# EAGLE design simple-spectro (EAGLE 9.2.2)
DELETE: MF
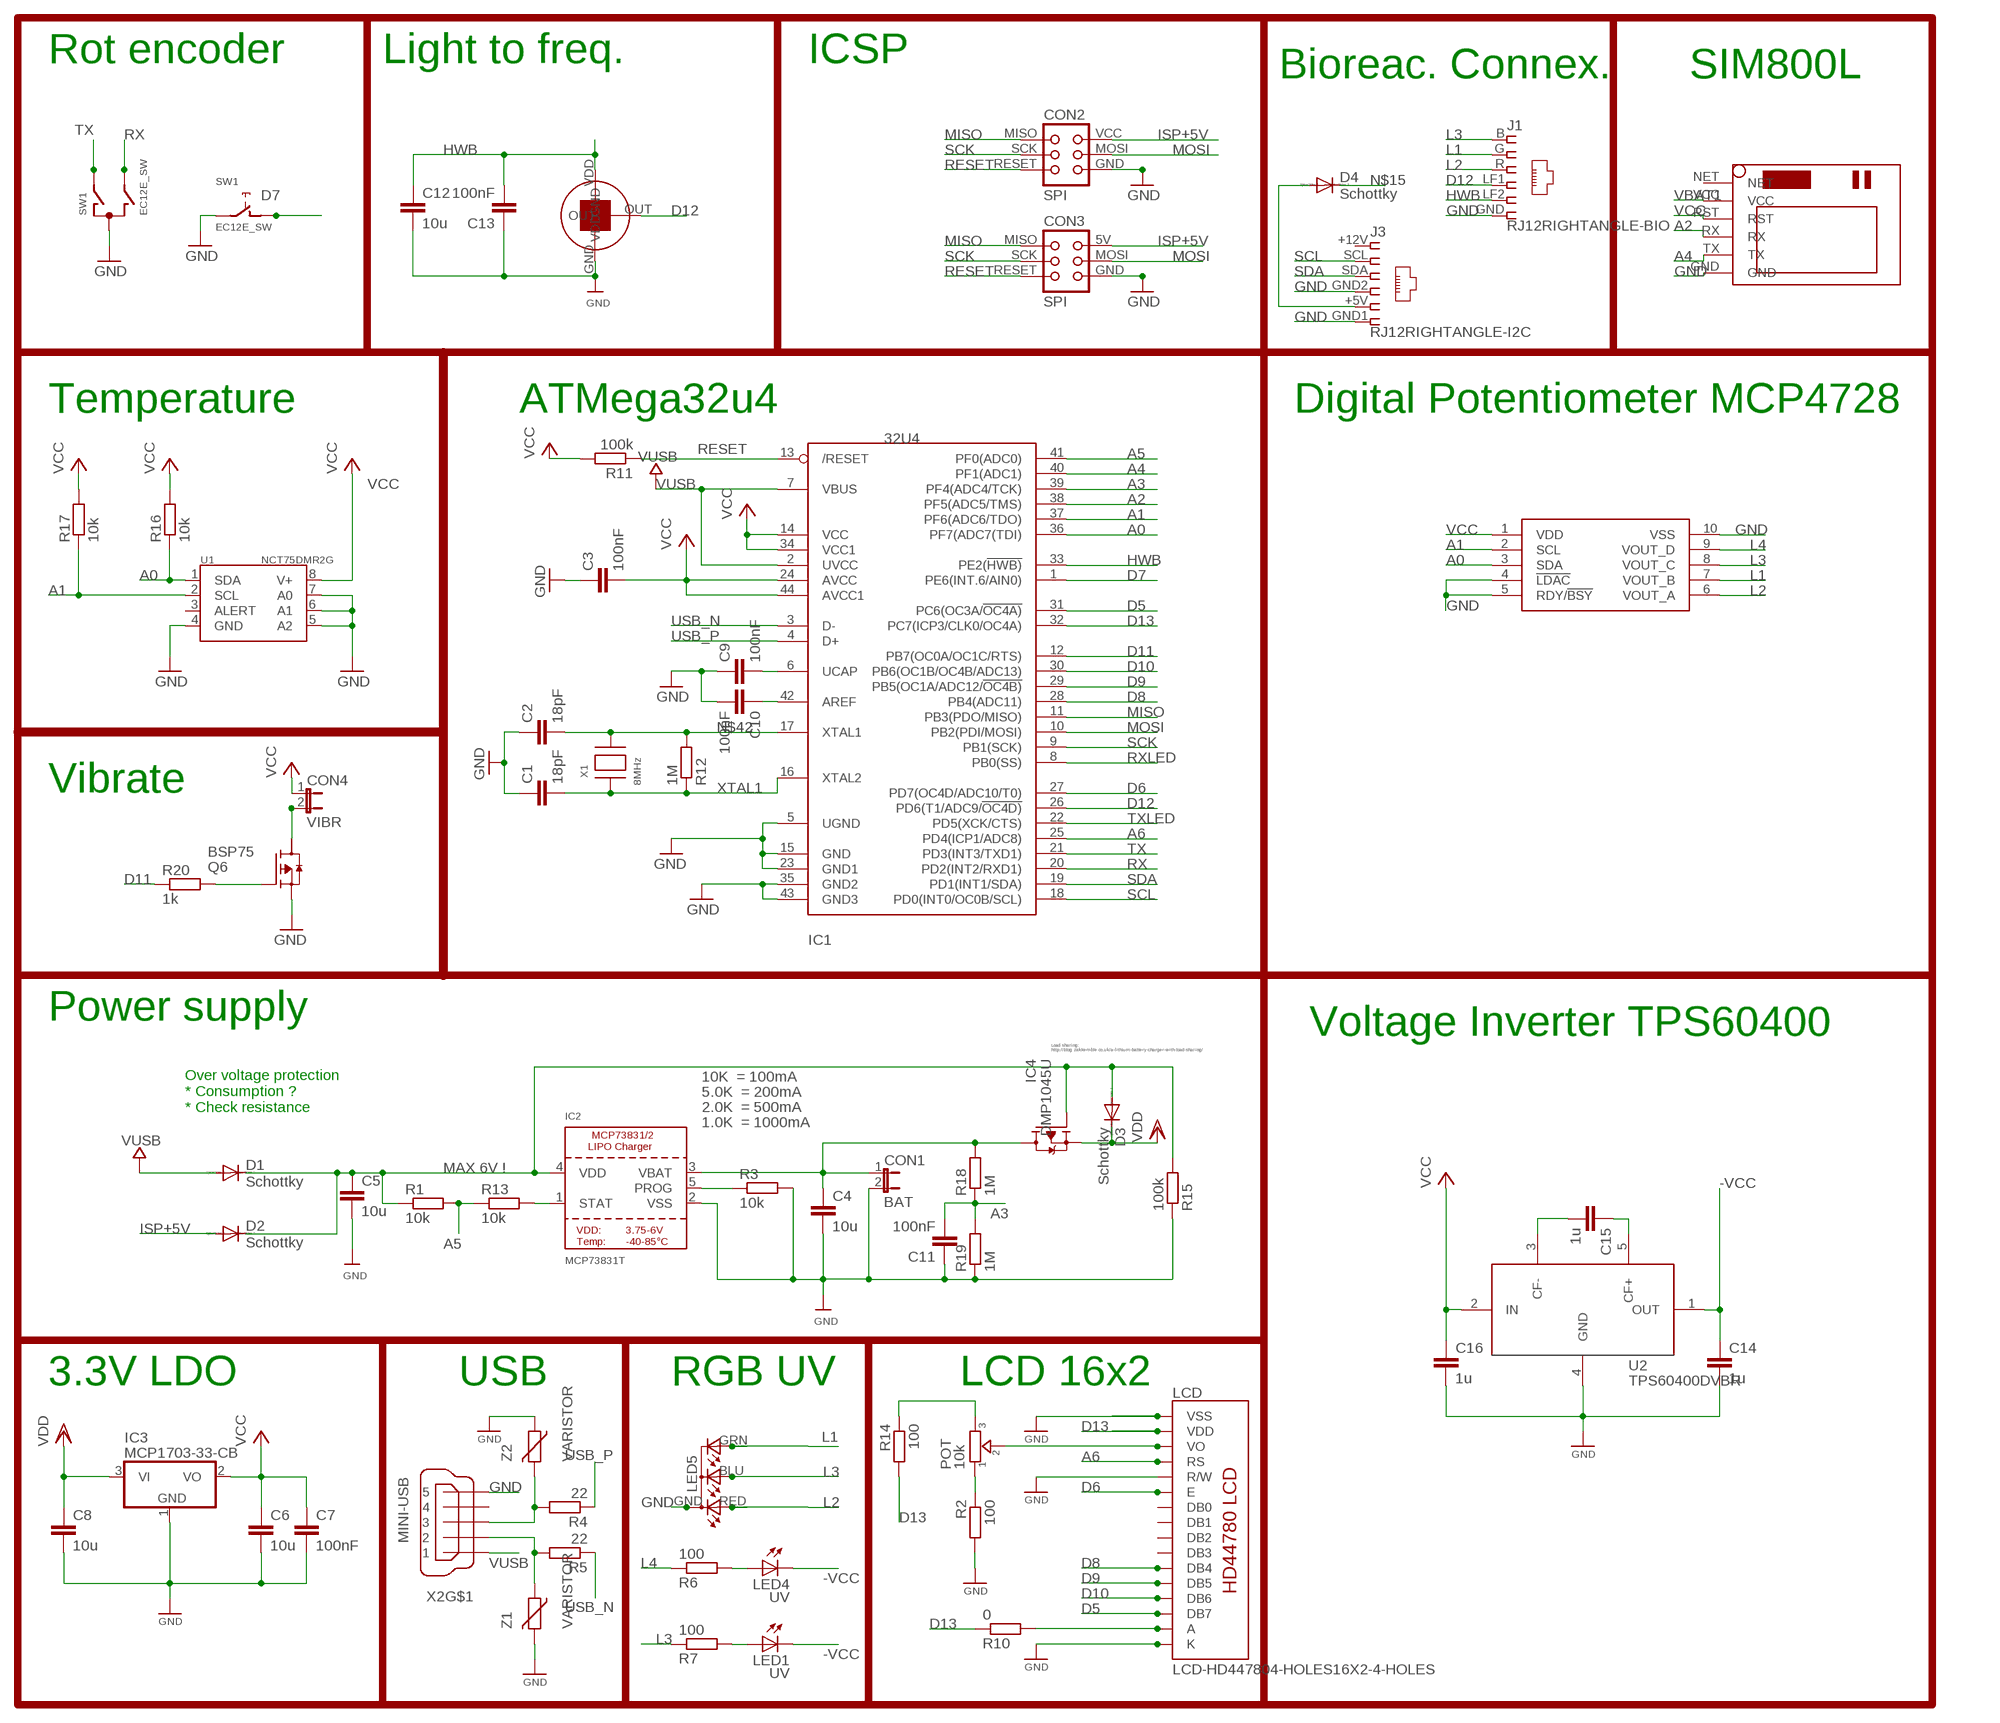
[diagram p0: schematic, sheet 1]

## Parts
C1  18pF  C-EUC0805K  [C0805K]
C2  18pF  C-EUC0805K  [C0805K]
C3  100nF  C-EUC0805K  [C0805K]
C4  10u  C-EUC0805K  [C0805K]
C5  10u  C-EUC0805K  [C0805K]
C6  10u  C-EUC0805K  [C0805K]
C7  100nF  C-EUC0805K  [C0805K]
C8  10u  C-EUC0805K  [C0805K]
C9  100nF  C-EUC0805K  [C0805K]
C10  100nF  C-EUC0805K  [C0805K]
C11  100nF  C-EUC0805K  [C0805K]
C12  10u  C-EUC0805K  [C0805K]
C13  100nF  C-EUC0805K  [C0805K]
C14  1u  C-EUC0805K  [C0805K]
C15  1u  C-EUC0805K  [C0805K]
C16  1u  C-EUC0805K  [C0805K]
CON1  BAT  JP1E  [JP1]
CON2  SPI  TINYISP  [TINYISP]
CON3  SPI  TINYISPT  [TC2030-MCP-NL]
CON4  VIBR  JP1E  [JP1]
D1  Schottky  MBR0520LT  [SOD123]
D2  Schottky  MBR0520LT  [SOD123]
D3  Schottky  MBR0520LT  [SOD123]
D4  Schottky  MBR0520LT  [SOD123]
IC1  32U4  ATMEGA32U4-AU  [TQFP44]
IC2  MCP73831T  MCP73831/2  [SOT23-5]
IC3  MCP1703-33-CB  MCP1703CB  [SOT23]
IC4  DMP1045U  TRANSISTOR_FET_TSM2301CX  [SOT-23]
J1  RJ12RIGHTANGLE-BIO  [RJ12-RIGHTRANGE-RGB]
J3  RJ12RIGHTANGLE-I2C  [RJ12-RIGHTANGLE-I2C]
LCD  LCD-HD447804-HOLES16X2-4-HOLES  [LCD-16X2-4HOLES]
LED1  UV  LED5MM  [LED5MM]
LED4  UV  LED5MM  [LED5MM]
LED5  RGB-COMMON-CATHODE  [LED-TRICOLOR-THROUGHHOLE]
POT  10k  TRIMMER-3362P  [TRIMMER_3362P]
Q6  BSP75  [PG-SOT-223]
R1  10k  R-EU_R0805  [R0805]
R2  100  R-EU_R0805  [R0805]
R3  10k  R-EU_R0805  [R0805]
R4  22  R-EU_R0805  [R0805]
R5  22  R-EU_R0805  [R0805]
R6  100  R-EU_R0805  [R0805]
R7  100  R-EU_R0805  [R0805]
R10  0  R-EU_R0805  [R0805]
R11  100k  R-EU_R0805  [R0805]
R12  1M  R-EU_R0805  [R0805]
R13  10k  R-EU_R0805  [R0805]
R14  100  R-EU_R0805  [R0805]
R15  100k  R-EU_R0805  [R0805]
R16  10k  R-EU_R0805  [R0805]
R17  10k  R-EU_R0805  [R0805]
R18  1M  R-EU_R0805  [R0805]
R19  1M  R-EU_R0805  [R0805]
R20  1k  R-EU_R0805  [R0805]
SW1  EC12E_SW  [ALPS_EC12E_SW]
U1  NCT75DMR2G  TMP75DGK  [MSOP8]
U2  TPS60400DVBR  [SOT23-5]
U$1  SIM800LMODULE  [SIM800LMODULE]
U$4  MCP4728  [MSOP10]
U$7  TSL237  [TSL237]
X1  8MHz  XTALNX6035  [NX6035]
X2  MINI-USB  MINI-USB-SCHIELD-32005-201  [32005-201]
Z1  VARISTOR  VARISTORCN0603  [CT/CN0603]
Z2  VARISTOR  VARISTORCN0603  [CT/CN0603]

## Nets
-VCC: C14.1 LED1.K(C) LED4.K(C) U2.1(OUT)
A0: IC1.36(PF7(ADC7(TDI)) R16.1 U1.1(SDA) U$4.3(SDA)
A1: IC1.37(PF6(ADC6/TDO)) R17.1 U1.2(SCL) U$4.2(SCL)
A2: IC1.38(PF5(ADC5/TMS)) U$1.RX
A3: C11.2 IC1.39(PF4(ADC4/TCK)) R18.1 R19.2
A4: IC1.40(PF1(ADC1)) U$1.TX
A5: IC1.41(PF0(ADC0)) R1.2 R13.1
A6: IC1.25(PD4(ICP1/ADC8)) LCD.4(RS)
AREF: C10.1 IC1.42(AREF)
D5: IC1.31(PC6(OC3A/!OC4A)) LCD.14(DB7)
D6: IC1.27(PD7(OC4D/ADC10/T0)) LCD.6(E)
D7: IC1.1(PE6(INT.6/AIN0)) SW1.D
D8: IC1.28(PB4(ADC11)) LCD.11(DB4)
D9: IC1.29(PB5(OC1A/ADC12/!OC4B)) LCD.12(DB5)
D10: IC1.30(PB6(OC1B/OC4B/ADC13)) LCD.13(DB6)
D11: IC1.12(PB7(OC0A/OC1C/RTS)) R20.1
D12: IC1.26(PD6(T1/ADC9/!OC4D)) J1.LF1 U$7.OUT
D13: IC1.32(PC7(ICP3/CLK0/OC4A)) LCD.2(VDD) R10.1 R14.2
GND [power]: C1.1 C2.1 C3.1 C4.2 C5.2 C6.2 C7.2 C8.2 C9.1 C10.2 C11.1 C12.2 C13.1 C14.2 C16.2 CON1.2 CON2.GND CON3.GND IC1.5(UGND) IC1.15(GND) IC1.23(GND1) IC1.35(GND2) IC1.43(GND3) IC2.2(VSS) IC3.1(GND) J1.GND J3.GND1 J3.GND2 LCD.1(VSS) LCD.5(R/W) LCD.16(K) LED5.GND(A2) Q6.3(S) R2.2 R3.2 R15.1 R19.1 SW1.C SW1.E U1.4(GND) U1.5(A2) U1.6(A1) U1.7(A0) U2.4(GND) U$1.GND U$4.4(!LDAC) U$4.5(RDY/!BSY) U$4.10(VSS) U$7.GND X2.5 Z1.2 Z2.1
HWB: C12.1 C13.2 IC1.33(PE2(!HWB)) J1.LF2 U$7.VDD
ISP+5V: CON2.VCC CON3.5V(VCC) D2.A
L1: J1.G LED5.GRN(CGREEN) U$4.7(VOUT_B)
L2: J1.R LED5.RED(CRED) U$4.6(VOUT_A)
L3: J1.B LED5.BLU(CBLUE) R7.1 U$4.8(VOUT_C)
L4: R6.1 U$4.9(VOUT_D)
MISO: CON2.MISO CON3.MISO IC1.11(PB3(PDO/MISO))
MOSI: CON2.MOSI CON3.MOSI IC1.10(PB2(PDI/MOSI))
N$1: C9.2 IC1.6(UCAP)
N$2: LCD.3(VO) POT.2
N$3: D4.A J3.+5V
N$4: POT.1 R2.1
N$5: IC2.1(STAT) R13.2
N$6: IC2.5(PROG) R3.1
N$7: LED4.A R6.2
N$8: Q6.1(G) R20.2
N$9: LED1.A R7.2
N$11: LCD.15(A) R10.2
N$12: POT.3 R14.1
N$14: CON4.2 Q6.2(D)
N$15: C5.1 D1.C D2.C D3.A D4.C IC2.4(VDD) IC4.1(G) R1.1 R15.2
N$17: C15.2 U2.3(CF-)
N$18: C15.1 U2.5(CF+)
N$42: C2.2 IC1.17(XTAL1) R12.2 X1.P$2
RESET: CON2.RESET CON3.RESET IC1.13(/RESET) R11.1
RX: IC1.20(PD2(INT2/RXD1)) SW1.B
RXLED: IC1.8(PB0(SS))
SCK: CON2.SCK CON3.SCK IC1.9(PB1(SCK))
SCL: IC1.18(PD0(INT0/OC0B/SCL)) J3.SCL
SDA: IC1.19(PD1(INT1/SDA)) J3.SDA
TX: IC1.21(PD3(INT3/TXD1)) SW1.A
TXLED: IC1.22(PD5(XCK/CTS))
USB_N: IC1.3(D-) R5.1
USB_P: IC1.4(D+) R4.1
USBC_N: R5.2 X2.2 Z1.1
USBC_P: R4.2 X2.3 Z2.2
VBAT1: C4.1 CON1.1 IC2.3(VBAT) IC4.3(D) R18.2 U$1.VCC
VCC: C3.2 C6.1 C7.1 C16.1 CON4.1 IC1.14(VCC) IC1.24(AVCC) IC1.34(VCC1) IC1.44(AVCC1) IC3.2(VO) R11.2 R16.2 R17.2 U1.8(V+) U2.2(IN) U$1.RST U$4.1(VDD)
VDD [power]: C8.1 D3.C IC3.3(VI) IC4.2(S)
VUSB: D1.A IC1.2(UVCC) IC1.7(VBUS) X2.1
XTAL1: C1.2 IC1.16(XTAL2) R12.1 X1.P$1
Unconnected: LCD.7(DB0) LCD.8(DB1) LCD.9(DB2) LCD.10(DB3) Q6.4(D) SW1.GND1(G) SW1.GND2(G) U1.3(ALERT) U$1.NET X2.4 X2.M1(S:S1) X2.M2(S:S2) X2.M3(S:S3) X2.M4(S:S4)

## Notes on the sheet
- Rot encoder | Light to freq. | ICSP
- Bioreac. Connex. | SIM800L
- Temperature | ATMega32u4 | Digital Potentiometer MCP4728
- Vibrate
- Power supply
- Voltage Inverter TPS60400
- Load sharing:
  http://blog.zakkemble.co.uk/a-lithium-battery-charger-with-load-sharing/
- 10K  = 100mA
- 5.0K  = 200mA
- Over voltage protection
  * Consumption ?
  * Check resistance
- 2.0K  = 500mA
- 1.0K  = 1000mA
- MAX 6V !
- 3.3V LDO | USB | RGB UV | LCD 16x2

## Power pins joined to a net without a drawn wire
1: J3.+12V

## Library data of the parts
C1 C2 = rcl:C-EU: CAPACITOR, European symbol; ELECROW: C1797; LCSC: C1797; MPN: 77-VJ1206A180JXXPBC
C3 C7 C9-C11 C13 = rcl:C-EU: CAPACITOR, European symbol; ELECROW: C49678; LCSC: C49678; MPN: 80-C1206C104K5R
C4-C6 C8 C12 C14-C16 = rcl:C-EU: CAPACITOR, European symbol; ELECROW: C15850; LCSC: C15850; MPN: 77-VJ1206V106ZXQTBC
CON1 CON4 = jumper:JP1E: JUMPER
CON2 = lpatiny:TINYISP: CONNECTOR; OC_FARNELL: unknown; OC_NEWARK: unknown
CON3 = lpatiny:TINYISP: CONNECTOR
D1-D4 = diode:MBR0520LT: SCHOTTKY BARRIER RECTIFIER Source: http://onsemi.com .. MBR0520LT1-D.pdf; LCSC: C82544; MPN: 621-1N5819HW-F
IC1 = adafruit:ATMEGA32U4: http://www.ladyada.net/library/eagle; LCSC: C44854; MPN: 556-ATMEGA32U4RC-AU
IC2 = microbuilder:MCP73831/2: MCP73831/2 LIPO Charger VDD: 3.75 - 6V Temp -40 - 85°C Programmable Charge Rate: 15-500mA NOTE: STAT is a tri-state logic output on the MCP73831 and an open-drain output on the MCP73832. SOT23-5 with 4.2V output and tri-state logic on STAT = MCP73831T-2ACI/OT; LCSC: C14879; MPN: 579-MCP73831T-3ACIOT
IC3 = linear:MCP1703: 250 mA, 16V, Low Quiescent Current LDO Regulator Source: http://ww1.microchip.com/downloads/en/DeviceDoc/22049b.pdf; LCSC: C53352
IC4 = dp_devices:TRANSISTOR_FET_TSM2301CX: 20V P-Channel Enhancement Mode MOSFET; LCSC: C110499; MPN: 621-DMP1045U-7
J1 = mercury:RJ12: CORCOM Modular RJ Jacks No Shield Source: www.tycoelectronics.com .. ENG_DS_1654001_1099_RJ_L_0507.pdf
J3 = lpatiny:RJ12: CORCOM Modular RJ Jacks No Shield Source: www.tycoelectronics.com .. ENG_DS_1654001_1099_RJ_L_0507.pdf
LCD = HD44780LCD:LCD-HD44780
LED1 LED4 = SparkFun:LED: LEDs Standard schematic elements and footprints for 5mm, 3mm, 1206, and 0603 sized LEDs. 5mm - Spark Fun Electronics SKU : COM-00529 (and others)
LED5 = lpatiny:RGB-COMMON-CATHODE
POT = dp_devices:TRIMMER: Trimmer resistor
Q6 = lpatiny:BSP75: SIPMOS (R) Small-Signal-Transistor P-Channel (2 Drain) Source: http://www.infineon.com/dgdl/BSP613P_Rev2.4.pdf; OC_FARNELL: unknown; OC_NEWARK: unknown
R1 R3 R13 R16 R17 = rcl:R-EU_: RESISTOR, European symbol; ELECROW: C17414; LCSC: C17414
R2 R6 R7 R14 = rcl:R-EU_: RESISTOR, European symbol; ELECROW: C17408; LCSC: C17408
R4 R5 = rcl:R-EU_: RESISTOR, European symbol; ELECROW: C17561; LCSC: C17561
R10 = rcl:R-EU_: RESISTOR, European symbol; ELECROW: C17477; LCSC: C17477
R11 R15 = rcl:R-EU_: RESISTOR, European symbol; ELECROW: C17407; LCSC: C17407; MPN: RC1206FR-07100KL
R12 R18 R19 = rcl:R-EU_: RESISTOR, European symbol; ELECROW: C17514; LCSC: C17514
R20 = rcl:R-EU_: RESISTOR, European symbol; ELECROW: C17513; LCSC: C17513
SW1 = switch-alps:EC12E_SW: ALPS rotary Encoder EC12E series with switch; MPN: EC12E2424407; OC_FARNELL: 1520813; OC_NEWARK: 74M1068
U1 = ti_tmp:TMP75; LCSC: C94387
U2 = TPS6040x:TPS6040*: Texas Instruments TPS4060x • Inverts Input Supply Voltage • Up to 60-mA Output Current • Only Three Small 1-μF Ceramic Capacitors Needed • Input Voltage Range From 1.6 V to 5.5 V • PowerSave-Mode for Improved Efficiency at Low- Output Currents (TPS60400) • Device Quiescent Current Typical 65 μA • Integrated Active Schottky-Diode for Start-up Into Load • Small 5-Pin SOT-23 Package • Evaluation Module Available TPS60400EVM-178 Datasheet <http://www.ti.com/lit/ds/symlink/tps60400.pdf>; DIST: FARNELL; MOQ: 3000; SMD_MARKING: PFKI
U$1 = SIM800L_ONELINE:SIM800LMODULE: SIM800L Module
U$4 = Eagle-Library:MCP4728
U$7 = lpatiny:TSL237
X1 = lpatiny:XTAL: Low cost SMT crystals, no capacitors included http://www.ladyada.net/library/eagle; LCSC: C122522; MPN: 729-F60800010
X2 = con-cypressindustries:MINI-USB-SCHIELD-: MINI USB-B Conector Source: www.cypressindustries.com; LCSC: C46391; MPN: 649-10033526-N3212LF
Z1 Z2 = varistor:VARISTOR: VARISTOR; LCSC: C126845

## Net classes
0 default: width 0.203 mm, clearance 0.25 mm
1 power: width 0.406 mm, drill 0.305 mm, clearance 0.25 mm
2 VIN: width 0.406 mm, clearance 0.25 mm
3 fine: width 0.406 mm, clearance 0.25 mm
4 aref: width 0.406 mm, clearance 0.25 mm

## Board
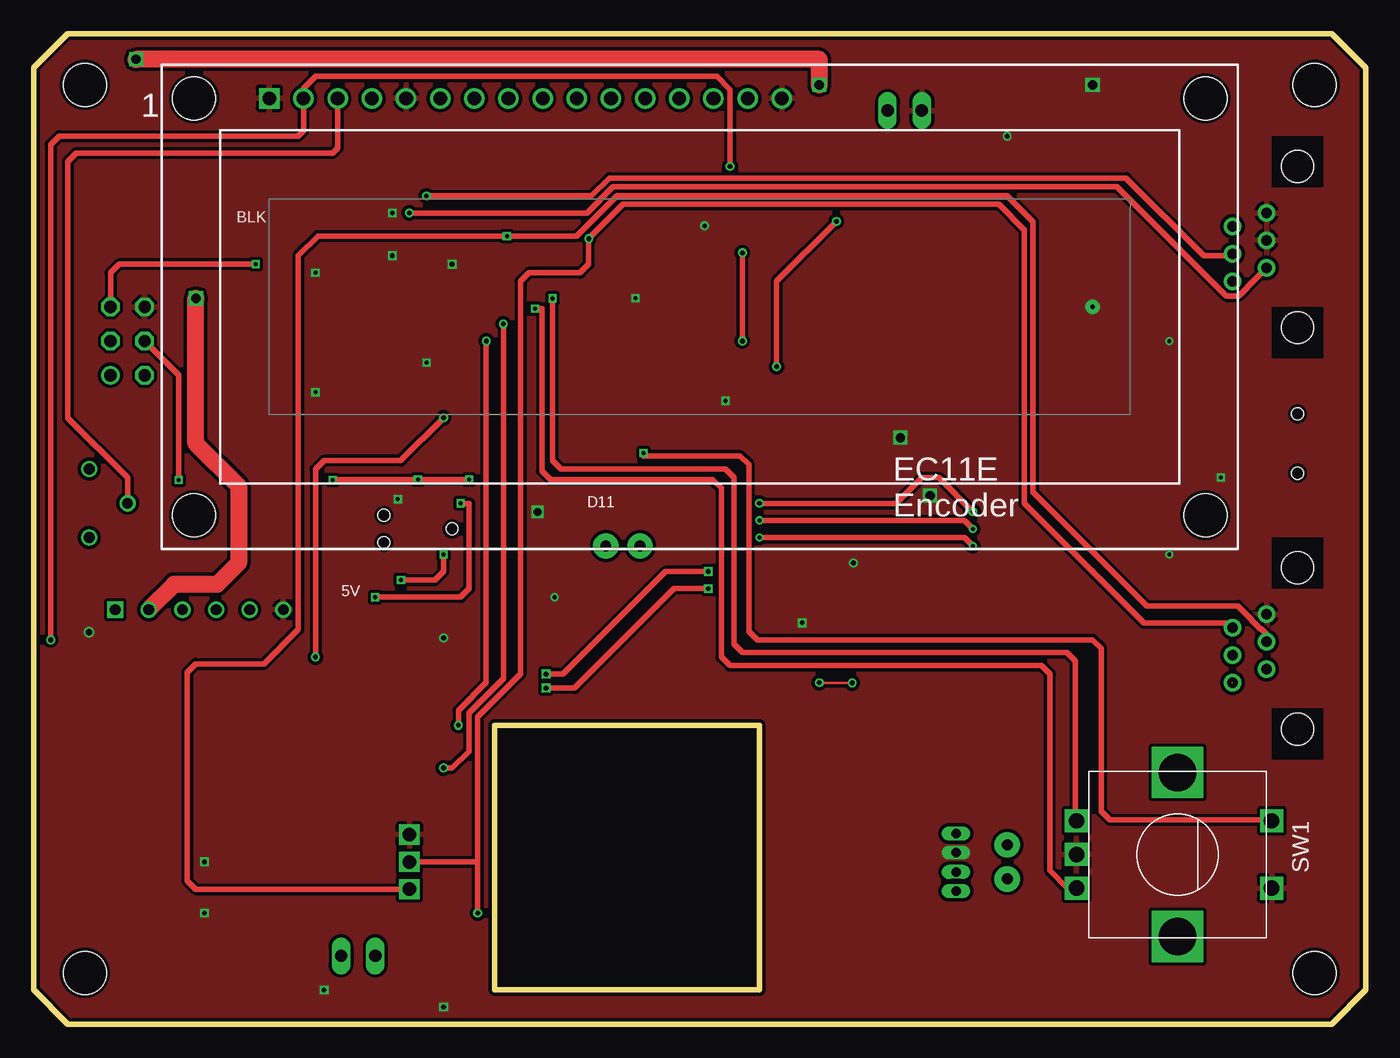
[diagram p1: board, top side]
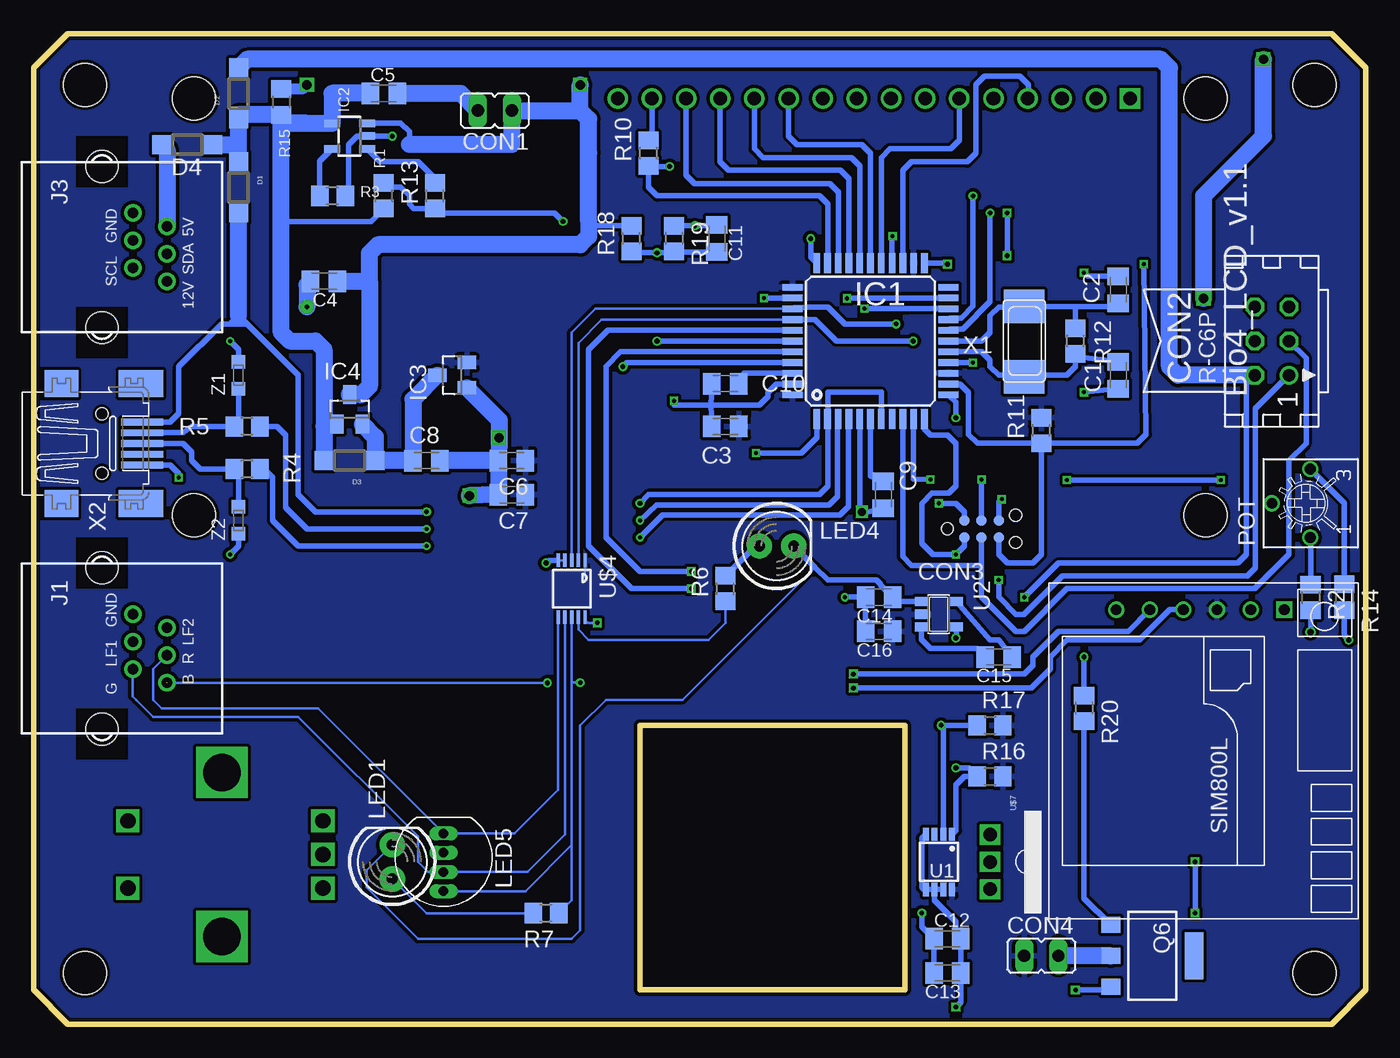
[diagram p2: board, bottom side, seen from below]

Size 99.06 x 73.66 mm. Coordinates in mm from the lower left corner, seen from the top.
Outline: 34.29,22.23 53.98,22.23 53.98,2.54 34.29,2.54 34.29,22.23
Outline: 0,71.12 0,2.54 2.54,0 96.52,0 99.06,2.54 99.06,71.12 96.52,73.66 2.54,73.66 0,71.12
Copper layers (1*16): Top 0.035mm / dielectric 0.2mm / Bottom 0.035mm
Design rules "SeeedStudio_DRU_no_angle_20130527 *": minimum track width 6mil, minimum drill 12mil, track to track 6mil, track to pad 6mil, pad to pad 6mil, via to via 6mil, smd to smd 0mil, copper to edge 10mil, drill to drill 10mil, minimum pad ring 6mil, minimum via ring 6mil, stop-mask expansion 2mil, vias tented up to drill 25mil, thermal gap 10mil
Holes 3.2 mm at 3.81,69.85 3.81,3.81 95.25,69.85 95.25,3.81

### Footprints (pad centres in the part's own frame; a part is rotated, then mirrored left to right if it is on the bottom)
C0805K = smd 1.3 x 1.6: 1 -1,0; 2 1,0
JP1 = drill 0.914 long: 1 0,-1.27; 2 0,1.27
TINYISP = drill 0.914 octagon: GND 2.54,1.27; MOSI 0,1.27; RESET 2.54,-1.27; SCK 0,-1.27; VCC -2.54,1.27 | drill 0.914: MISO -2.54,-1.27
TC2030-MCP-NL = smd 0.787 x 0.787: 5V 1.27,0.635; GND 3.81,0.635; MISO 1.27,-0.635; MOSI 2.54,0.635; RESET 3.81,-0.635; SCK 2.54,-0.635 | hole 0.889: 0,0; 5.08,-1.016; 5.08,1.016
SOD123 = smd 1.4 x 1.4: A 1.9,0; C -1.9,0
TQFP44 = smd 1.5 x 0.5: 1 -5.8,4; 2 -5.8,3.2; 3 -5.8,2.4; 4 -5.8,1.6; 5 -5.8,0.8; 6 -5.8,0; 7 -5.8,-0.8; 8 -5.8,-1.6; 9 -5.8,-2.4; 10 -5.8,-3.2; 11 -5.8,-4; 23 5.8,-4; 24 5.8,-3.2; 25 5.8,-2.4; 26 5.8,-1.6; 27 5.8,-0.8; 28 5.8,0; 29 5.8,0.8; 30 5.8,1.6; 31 5.8,2.4; 32 5.8,3.2; 33 5.8,4 | smd 0.5 x 1.5: 12 -4,-5.8; 13 -3.2,-5.8; 14 -2.4,-5.8; 15 -1.6,-5.8; 16 -0.8,-5.8; 17 0,-5.8; 18 0.8,-5.8; 19 1.6,-5.8; 20 2.4,-5.8; 21 3.2,-5.8; 22 4,-5.8; 34 4,5.8; 35 3.2,5.8; 36 2.4,5.8; 37 1.6,5.8; 38 0.8,5.8; 39 0,5.8; 40 -0.8,5.8; 41 -1.6,5.8; 42 -2.4,5.8; 43 -3.2,5.8; 44 -4,5.8
SOT23-5 = smd 0.55 x 1.2: 1 -0.95,-1.3; 2 0,-1.3; 3 0.95,-1.3; 4 0.95,1.3; 5 -0.95,1.3
SOT23 = smd 1 x 1.4: 1 -0.95,-1.1; 2 0.95,-1.1; 3 0,1.1
SOT-23 = smd 1 x 1.4: 1 -0.95,-1.1; 2 0.95,-1.1; 3 0,1.1
RJ12-RIGHTRANGE-RGB = drill 0.8 pad 1.3: B 2.54,4.84; G 1.54,2.3; GND -2.54,2.3; LF1 -0.5,2.3; LF2 -1.54,4.84; R 0.5,4.84 | hole 2.36: -6,0; 6,0
RJ12-RIGHTANGLE-I2C = drill 0.8 pad 1.3: +5V -1.54,4.84; +12V 2.54,4.84; GND1 -2.54,2.3; GND2 -0.5,2.3; SCL 1.54,2.3; SDA 0.5,4.84 | hole 2.36: -6,0; 6,0
LCD-16X2-4HOLES = drill 1.016 square: 1 -32,15.5 | drill 1.016: 2 -29.46,15.5; 3 -26.92,15.5; 4 -24.38,15.5; 5 -21.84,15.5; 6 -19.3,15.5; 7 -16.76,15.5; 8 -14.22,15.5; 9 -11.68,15.5; 10 -9.14,15.5; 11 -6.6,15.5; 12 -4.06,15.5; 13 -1.52,15.5; 14 1.02,15.5; 15 3.56,15.5; 16 6.1,15.5 | hole 3.2: -37.6,15.5; -37.6,-15.5; 37.6,-15.5; 37.6,15.5
LED5MM = drill 0.813 pad 1.88: A -1.27,0; K 1.27,0
LED-TRICOLOR-THROUGHHOLE = drill 0.7 long: BLU 2.175,0; GND -0.682,0; GRN 0.746,0; RED -2.111,0
TRIMMER_3362P = drill 0.8: 1 -2.54,-0.31; 2 0,2.54; 3 2.54,-0.31
PG-SOT-223 = smd 1.2 x 1.4: 1 -2.311,-3.099; 2 0,-3.099; 3 2.311,-3.099 | smd 3.5 x 1.4: 4 0,3.099
R0805 = smd 1.3 x 1.5: 1 -0.95,0; 2 0.95,0
ALPS_EC12E_SW = drill 1.143 square: A -2.5,-7.5; B 2.5,-7.5; C 0,-7.5; D -2.5,7; E 2.5,7 | drill 2.794 square: GND1 -6.1,0; GND2 6.1,0
MSOP8 = smd 0.45 x 1: 1 -0.975,-2.05; 2 -0.325,-2.05; 3 0.325,-2.05; 4 0.975,-2.05; 5 0.975,2.05; 6 0.325,2.05; 7 -0.325,2.05; 8 -0.975,2.05
SOT23-5' = smd 0.69 x 0.99: 1 -0.95,-1.29; 2 0,-1.29; 3 0.95,-1.29; 4 0.95,1.3; 5 -0.95,1.3
SIM800LMODULE = drill 0.8: GND -10.5,-6.5; RST -10.5,1; RX -10.5,-1.5; TX -10.5,-4; VCC -10.5,3.5 | drill 0.8 square: NET -10.5,6
MSOP10 = smd 0.25 x 1: 1 -1,-2.113; 2 -0.5,-2.113; 3 0,-2.113; 4 0.5,-2.113; 5 1,-2.113; 6 1,2.113; 7 0.5,2.113; 8 0,2.113; 9 -0.5,2.113; 10 -1,2.113
TSL237 = drill 1 pad 1.27 square: GND -2.032,-2.54; OUT 2.032,-2.54; VDD 0,-2.54
NX6035 = smd 2.5 x 3: P$1 2.665,0; P$2 -2.565,0
32005-201 = smd 3.1 x 0.5: 1 3,1.6; 2 3,0.8; 3 3,0; 4 3,-0.8; 5 3,-1.6 | smd 2.5 x 2: M1 -3,-4.45; M2 -3,4.45 | smd 3.3 x 2: M3 2.9,4.45; M4 2.9,-4.45 | hole 0.9: 0,2.2; 0,-2.2
CT/CN0603 = smd 1 x 1: 1 -1,0; 2 1,0

### Placement (x,y rotation side)
C1  18.41,48.26 90 bottom
C2  18.41,54.61 270 bottom
C3  47.62,44.45 0 bottom
C4  77.47,55.24 180 bottom
C5  73.03,69.22 0 bottom
C6  63.5,41.91 180 bottom
C7  63.5,39.37 180 bottom
C8  69.85,41.91 0 bottom
C9  35.88,39.37 90 bottom
C10  47.62,47.62 180 bottom
C11  48.26,58.42 270 bottom
C12  31.11,6.35 0 bottom
C13  31.11,3.81 180 bottom
C14  36.2,31.75 180 bottom
C15  27.3,27.3 180 bottom
C16  36.2,29.21 180 bottom
CON1  64.77,67.94 90 bottom
CON2  6.99,50.8 90 bottom
CON3  31.11,36.83 0 bottom
CON4  24.13,5.08 270 bottom
D1  83.82,62.23 270 bottom
D2  83.82,69.22 90 bottom
D3  75.56,41.91 180 bottom
D4  87.63,65.41 180 bottom
IC1  36.83,50.8 90 bottom
IC2  75.56,66.04 90 bottom
IC3  67.94,48.26 90 bottom
IC4  75.56,45.72 0 bottom
J1  93.98,27.94 270 bottom
J3  93.98,57.78 270 bottom
LCD  49.53,53.34 0 top
LED1  72.39,12.06 90 bottom
LED4  43.81,35.56 0 bottom
LED5  68.58,12.06 270 bottom
POT  4.45,38.73 90 bottom
Q6  15.88,5.08 270 bottom
R1  73.03,61.59 90 bottom
R2  4.11,31.72 270 bottom
R3  76.83,61.59 0 bottom
R4  83.19,41.27 180 bottom
R5  83.19,44.45 180 bottom
R6  47.62,32.38 90 bottom
R7  60.96,8.26 180 bottom
R10  53.34,64.77 90 bottom
R11  24.13,44.16 90 bottom
R12  21.59,50.8 90 bottom
R13  69.22,61.59 90 bottom
R14  1.61,31.75 270 bottom
R15  80.64,68.58 270 bottom
R16  27.94,18.41 0 bottom
R17  27.94,22.23 0 bottom
R18  54.61,58.42 90 bottom
R19  51.44,58.42 270 bottom
R20  20.95,23.5 270 bottom
SW1  85.05,12.62 270 top
U1  31.75,12.06 180 bottom
U2  TPS60400DVBR  [SOT23-5']  31.75,30.48 270 bottom
U$1  12.06,20.32 270 bottom
U$4  59.05,32.38 180 bottom
U$7  25.4,12.06 270 bottom
X1  25.4,50.8 270 bottom
X2  93.98,43.18 0 bottom
Z1  83.82,48.26 90 bottom
Z2  83.82,37.47 90 bottom

### Tracks (layer width: path | path; a pad name or v marks a point on that pad's centre or on a via)
-VCC
  Bottom 0.203: LED1.K 74.3,11.43 74.3,10.16 70.48,6.35 59.05,6.35 58.42,6.99 58.42,22.23 56.52,24.13 50.8,24.13 40.96,33.97
  Bottom 0.406: U2.1 34.88,31.43 arc90 C14.1 36.09,32.65 36.09,32.74 36.37,33.02 40.01,33.02 40.96,33.97 LED4.K
A0  (via drill 0.35)
  Top 0.406: v34.92,52.07 34.92,25.69 32.36,23.13 32.36,20.3 31.11,19.05 v30.48,19.05
  Bottom 0.203: IC1.36 57.29,53.2 59.05,51.44 U$4.3
  Bottom 0.406: U1.1 30.48,14.41 30.48,17.78 29.84,18.41 R16.1 29.52,19.05 v30.48,19.05 | v34.92,52.07 38.73,52.07 40.01,53.34 41.65,53.34 41.69,53.3 42.53,53.3 IC1.36
A1  (via drill 0.35)
  Top 0.406: v33.66,50.8 33.66,25.4 31.58,23.33 v31.58,22.23
  Bottom 0.203: IC1.37 56.82,52.4 58.55,50.66 U$4.2
  Bottom 0.406: R17.1 v31.58,22.23 arc90 31.43,22.07 U1.2 | IC1.37 40.97,52.4 39.37,50.8 v33.66,50.8
A2  (via drill 0.35 pad 0.55)
  Top 0.406: v50.16,32.38 47.62,32.38 40.23,25 v38.1,25
  Bottom 0.406: IC1.38 56.35,51.6 57.78,50.16 57.78,35.56 54.61,32.38 v50.16,32.38 | v38.1,25 24.88,25 23.47,26.4 23.47,27.3 22.23,28.55 16.84,28.55 14.58,30.82 U$1.RX
A3  (via drill 0.35)
  Top 0.406: v52.7,50.8 v52.7,57.36
  Bottom 0.406: IC1.39 v52.7,50.8 | R18.1 54.5,57.36 v52.7,57.36 50.91,57.36 R19.2 51.38,57.42 C11.2
A4  (via drill 0.35 pad 0.55)
  Top 0.406: v50.16,33.66 46.99,33.66 39.37,26.04 v38.1,26.04
  Bottom 0.406: v50.16,33.66 53.98,33.66 56.52,36.2 56.52,48.9 55.41,50 IC1.40 | U$1.TX 17.68,29.21 22.86,29.21 24.77,27.3 24.77,26.67 25.4,26.04 v38.1,26.04
A5  (via drill 0.35)
  Top 0.406: v59.69,59.69 55.24,55.24 v55.24,48.9
  Bottom 0.406: R1.2 72.71,62.23 71.75,62.23 71.12,61.59 71.12,60.96 70.81,60.65 R13.1 68.89,60.33 60.33,60.33 v59.69,59.69 | v55.24,48.9 54.94,49.2 45.09,49.2 IC1.41
A6
  Bottom 0.406: LCD.4 25.08,68.84 25.08,69.85 25.72,70.48 28.36,70.48 29,69.85 29,64.77 29.64,64.14 33.8,64.14 34.43,63.5 IC1.25
AREF
  Bottom 0.406: IC1.42 46.23,48.4 C10.1
D5
  Bottom 0.406: LCD.14 50.55,63.14 49.91,62.5 39.87,62.5 39.23,61.87 IC1.31
D6
  Bottom 0.406: IC1.27 36.03,64.45 35.4,65.09 30.86,65.09 30.23,65.72 LCD.6
D7  (via drill 0.3)
  Top 0.406: v45.34,42.48 45.34,42.24 52.54,42.24 53.17,41.6 53.17,29.21 53.81,28.57 78.74,28.57 79.38,27.94 79.38,15.84 80.01,15.2 91.97,15.2 SW1.D
  Bottom 0.406: v45.34,42.48 41.97,42.48 40.83,43.62 IC1.1
D8
  Bottom 0.406: LCD.11 42.93,66.04 42.3,65.41 37.47,65.41 36.83,64.77 IC1.28
D9
  Bottom 0.406: LCD.12 45.47,65.09 44.84,64.45 38.27,64.45 37.63,63.82 IC1.29
D10
  Bottom 0.406: LCD.13 48.01,64.14 47.38,63.5 39.06,63.5 38.43,62.87 IC1.30
D11  (via drill 0.35)
  Top 0.406: v30.48,45.09 27.3,41.91 21.59,41.91 20.95,41.27 v20.95,27.3
  Bottom 0.406: IC1.12 30.48,46.25 v30.48,45.09 | v20.95,27.3 R20.1
D12  (via drill 0.3)
  Top 0.406: U$7.OUT 12.06,10.03 11.43,10.67 11.43,26.16 12.06,26.8 17.14,26.8 19.68,29.34 19.68,57.15 21.14,58.61 v35.19,58.61 40.36,58.61 43.37,61.62 72.37,61.62 74.32,59.67 74.32,39.59 82.79,31.11 89.53,31.11 90.58,30.07 90.58,30.02 91.22,29.38 91.27,29.38 91.68,28.97 J1.LF1
  Bottom 0.406: IC1.26 35.24,58.51 35.19,58.51 v35.19,58.61
D13  (via drill 0.35)
  Top 0.406: v51.78,63.78 51.78,69.51 50.8,70.48 20.95,70.48 20.07,69.6 LCD.2 20.07,66.42 19.68,66.04 1.91,66.04 1.27,65.41 v1.27,28.57
  Bottom 0.406: IC1.32 40.01,56.6 40.01,60.96 40.64,61.59 52.7,61.59 53.34,62.23 R10.1 53.3,63.78 v51.78,63.78 | R14.2 1.61,28.92 v1.27,28.57
GND  (via drill 0.3, 0.35, 0.35 pad 0.55, 0.35 pad 1.05, 0.45, 0.6, 0.7)
  Bottom 0.203: U$4.10 58.05,30.11 arc-90 57.78,29.84 v57.15,29.84 | U$4.4 U$4.5
  Bottom 0.406: C10.2 48.68,46.04 | 48.68,46.04 C3.1 | IC1.43 43.81,47.6 44.45,46.97 44.45,46.67 45.09,46.04 48.68,46.04 | v51.44,46.35 51.44,46.04 48.68,46.04 | C9.1 37.47,37.97 | IC1.5 37.63,37.97 37.47,37.97 | C7.2 64.77,39.37 | X2.5 88.9,41.58 88.27,40.95 v88.27,40.64 | IC1.35 v44.77,54 | IC1.15 v29.22,49.2 | v29.22,49.2 | CON3.GND 27.3,38.81 v27.08,39.04 | 37.47,37.97 v37.47,38.1 | C1.1 v20.95,46.99 | R3.2 75.65,61.59 75.65,65.41 75.01,66.04 IC2.2 v72.39,66.04 | U1.7 U1.6 | U1.6 U1.5 32.88,10.02 33.02,10.16 33.02,13.82 U1.4 | v20.95,55.88 20.68,55.61 C2.1 | R19.1 v49.89,59.37 48.31,59.37 C11.1 | R2.2 v4.12,29.15 | U1.6 32.08,9.21 30.48,7.62 30.48,6.71 C12.2 C13.1 30.11,1.64 v30.48,1.27 | Z1.2 83.82,50.16 v84.45,50.8 | Z2.1 83.82,35.56 v84.45,34.92 | U2.4 30.45,28.72 v30.48,28.72 | C16.2 C14.2 v38.73,31.75 | Q6.3 19.2,2.54 v21.59,2.54 | v26.67,57.15 v26.67,60.33 | v12.7,12.06 v12.7,8.26 | v31.11,56.52 31.2,56.6 IC1.23 | v60.96,34.29 60.75,34.5 U$4.5
  Bottom 0.813: v78.74,69.85 79.06,69.53 R15.1
  Bottom 1.27: C6.2 v64.45,43.62 64.45,44.91 IC3.1 | C6.2 C8.2 | C6.2 C7.2 | 64.77,39.37 v66.66,39.3 | C5.2 67.31,69.22 CON1.2 | C4.2 78.74,54.98 v78.74,53.34
  pour Top: 0,71.12 0,2.54 2.54,0 96.52,0 99.06,2.54 99.06,71.12 96.52,73.66 2.54,73.66
HWB  (via drill 0.35)
  Top 0.406: 33.02,12.06 33.02,22.86 36.2,26.04 36.2,55.24 36.83,55.88 40.64,55.88 41.27,56.52 v41.27,58.42 43.81,60.96 71.75,60.96 73.66,59.05 73.66,38.73 82.55,29.84 88.78,29.84 J1.LF2 | 33.02,12.06 v33.02,8.26 | U$7.VDD 33.02,12.06
  Bottom 0.406: C13.2 C12.1 33.02,7.25 v33.02,8.26 | IC1.33 41.27,57.05 v41.27,58.42
ISP+5V  (via drill 0.3)
  Top 0.406: v31.75,38.73 32.38,38.73 32.38,32.38 31.75,31.75 v25.4,31.75
  Bottom 0.406: CON3.5V 29.84,38.1 30.48,38.73 v31.75,38.73 | v25.4,31.75 22.86,34.29 9.53,34.29 8.89,34.92 8.89,47.62 CON2.VCC
  Bottom 1.27: CON2.VCC 13.97,48.26 14.61,48.9 14.61,71.12 15.24,71.75 83.19,71.75 D2.A
L1
  Bottom 0.203: U$4.7 59.55,14.11 62.34,11.32 LED5.GRN 69.74,11.32 70.48,12.06 70.48,13.97 79.38,22.86 90.17,22.86 91.44,24.13 91.68,24.37 J1.G
L2
  Bottom 0.203: U$4.6 60.05,17.41 63.29,14.18 LED5.RED 77.9,23.5 89.53,23.5 90.17,24.13 90.17,26.41 J1.R
L3  (via drill 0.35)  (1 unrouted)
  Top 0.203: v60.87,25.38 58.45,25.38 v58.42,25.4
  Bottom 0.203: U$4.8 59.05,25.4 | 59.05,25.4 59.05,13.34 | LED5.BLU 62.5,9.89 59.05,13.34 | 59.05,13.34 59.05,9.21 R7.1 | 59.05,25.4 v58.42,25.4 | v60.87,25.38 89.11,25.38
L4
  Bottom 0.203: U$4.9 58.55,29.34 57.78,28.57 48.9,28.57 47.62,29.84 R6.1
MISO  (via drill 0.3)
  Top 0.406: v27.3,33.02 29.84,33.02 30.48,33.66 v30.48,34.92
  Bottom 0.406: CON3.MISO 29.84,35.56 v30.48,34.92 32.2,34.92 33.02,35.75 33.02,38.73 32.26,39.49 30.99,39.49 30.48,40.01 30.48,43.18 31.11,43.81 32.38,43.81 32.83,44.26 IC1.11 | CON2.MISO 8.2,45.77 8.2,33.93 8.81,33.33 22.57,33.33 25.42,30.48 26.04,30.48 27.3,31.75 v27.3,33.02
MOSI  (via drill 0.3)
  Top 0.406: v32.38,40.5 v28.57,40.5 22.23,40.5 v22.23,40.47 | v10.79,40.47 10.79,48.26 CON2.MOSI
  Bottom 0.406: CON3.MOSI v28.57,40.5 | v22.23,40.47 v10.79,40.47 | IC1.10 33.63,40.52 v32.38,40.5
N$1
  Bottom 0.406: C9.2 36.83,40.77 IC1.6
N$2
  Top 0.406: LCD.3 22.61,65.16 22.23,64.77 3.17,64.77 2.54,64.14 2.54,45.09 6.99,40.64 POT.2
N$3
  Bottom 1.27: J3.+5V 89.14,65.02 D4.A
N$4
  Bottom 0.406: R2.1 4.12,36.17 POT.1
N$5
  Bottom 0.406: IC2.1 73.31,64.14 70.48,64.14 69.22,62.87 R13.2
N$6
  Bottom 0.406: IC2.5 77.78,64.17 R3.1
N$7
  Bottom 0.406: LED4.A 45.4,35.56 R6.2
N$8
  Bottom 0.406: Q6.1 20.95,9.37 R20.2
N$9
  Bottom 0.203: R7.2 69.85,8.26 LED1.A
N$11
  Bottom 0.406: LCD.15 53.09,66.42 R10.2
N$12
  Bottom 0.406: R14.1 1.61,38.75 POT.3
N$14
  Bottom 1.27: Q6.2 CON4.2
N$15
  Bottom 0.406: 80.64,59.69 73.98,59.69 R1.1 | IC4.1 76.69,44.45 77.47,44.45
  Bottom 1.27: D1.C 83.82,65.41 | 83.82,65.41 D2.C 83.82,67.63 R15.2 80.64,66.99 78.76,66.99 | 78.76,66.99 IC2.4 76.86,69.22 C5.1 | 78.76,66.99 80.64,66.97 80.64,59.69 80.64,51.44 80.01,50.8 78.11,50.8 77.47,50.16 77.47,44.45 D3.A | D4.C 83.82,65.41
N$17
  Bottom 0.406: C15.2 28.94,27.94 32.38,27.94 33.04,28.59 U2.3
N$18
  Bottom 0.406: U2.5 27.94,28.57 27.3,28.57 C15.1
N$42
  Bottom 0.406: IC1.17 28.57,50.8 27.94,51.44 27.94,52.7 27.3,53.34 25.4,53.34 X1.P$2 21.59,53.37 | 21.59,53.37 R12.2 | C2.2 18.66,53.37 21.59,53.37
RESET  (via drill 0.3)
  Top 0.406: v16.51,56.52 6.35,56.52 5.71,55.88 CON2.RESET
  Bottom 0.406: IC1.13 30.18,47.6 29.54,46.97 29.54,43.84 28.9,43.21 R11.1 | CON3.RESET 27.3,34.92 26.67,34.29 24.77,34.29 24.13,34.92 R11.1 | R11.1 16.98,43.21 16.35,43.85 v16.51,56.52
RX  (via drill 0.3)
  Top 0.406: v37.27,53.21 37.8,53.21 37.8,41.13 38.43,40.5 50.49,40.5 51.13,39.87 51.13,27.3 51.77,26.67 74.93,26.67 75.56,26.04 75.56,11.43 76.88,10.12 SW1.B
  Bottom 0.406: IC1.20 34.1,53.2 v37.27,53.21
SCK
  Bottom 0.406: CON3.SCK 28.57,34.12 | 28.57,34.12 33.8,34.12 34.43,34.76 IC1.9 | 28.57,34.12 28.57,31.75 26.04,29.21 25.4,29.21 22.23,32.38 8.26,32.38 5.71,34.92 5.71,41.91 4.45,43.18 4.45,49.53 CON2.SCK
SCL  (via drill 0.35)
  Top 0.406: v27.94,60.33 41.15,60.33 43.1,62.27 80.55,62.27 88.68,54.14 89.6,54.14 90.24,54.79 90.24,54.81 J3.SCL
  Bottom 0.406: IC1.18 30.93,51.7 29.96,51.7 27.94,53.72 v27.94,60.33
SDA  (via drill 0.35)
  Top 0.406: v29.21,61.59 41.49,61.59 42.82,62.93 81.22,62.93 87,57.15 89,57.15 J3.SDA
  Bottom 0.406: IC1.19 30.93,52.5 30.09,52.5 29.21,53.38 v29.21,61.59
TX  (via drill 0.3)
  Top 0.406: v38.59,53.98 38.59,41.91 39.23,41.27 51.44,41.27 52.07,40.64 52.07,28.27 52.7,27.64 76.83,27.64 77.47,27 77.47,15.2 SW1.A
  Bottom 0.406: IC1.21 v38.59,53.98
USB_N  (via drill 0.3)
  Top 0.406: v53.98,37.47 69.22,37.47 v69.85,36.83
  Bottom 0.406: IC1.3 39.29,45 39.29,39.25 39.93,38.61 52.75,38.61 v53.98,37.47 | R5.1 80.96,44.45 80.33,43.81 80.33,38.42 78.74,36.83 v69.85,36.83
USB_P  (via drill 0.3)
  Top 0.406: v53.98,36.2 69.22,36.2 v69.85,35.56
  Bottom 0.406: R4.1 81.92,41.27 81.28,40.64 81.28,37.47 79.38,35.56 v69.85,35.56 | IC1.4 38.47,45 38.47,38.49 39.1,37.86 52.31,37.86 v53.98,36.2
USBC_N
  Bottom 0.406: X2.2 87.94,43.98 87.3,44.45 R5.2 83.82,44.77 Z1.1
USBC_P
  Bottom 0.406: X2.3 87.94,43.18 87.3,42.55 87.3,41.91 86.67,41.27 R4.2 83.82,40.96 Z2.2
VBAT1  (via drill 0.7)
  Top 1.27: v58.42,69.85 58.42,71.75 v7.62,71.75 | v12.06,53.98 12.06,43.18 15.24,40.01 15.24,34.29 13.65,32.7 10.45,32.7 U$1.VCC
  Bottom 0.406: IC2.3 71.75,66.99 71.12,66.36 71.12,65.41 | R18.2 57.47,59.37 57.78,59.69
  Bottom 1.27: 71.12,65.41 63.5,65.41 CON1.1 58.42,67.94 | 58.42,67.94 57.78,67.31 57.78,64.77 57.78,59.69 57.78,58.59 58.42,57.96 73.45,57.96 74.08,57.32 74.08,55.24 | 74.08,55.24 74.08,47.44 74.72,46.81 75.56,46.81 IC4.3 | C4.1 74.08,55.24 | 58.42,67.94 v58.42,69.85 | v12.06,53.98 12.06,61.59 7.62,66.04 v7.62,71.75
VCC
  Bottom 0.203: U$4.1 58.05,33.29
  pour Bottom: 0,71.12 0,2.54 2.54,0 96.52,0 99.06,2.54 99.06,71.12 96.52,73.66 2.54,73.66
VDD
  Bottom 1.27: IC4.2 73.67,43.67 D3.C C8.1 70.85,46.45 IC3.3
VUSB  (via drill 0.35)
  Top 0.406: v69.85,38.1 67.31,40.64 66.04,40.64 64.14,38.73 v53.98,38.73
  Bottom 0.406: 40.01,45 40.01,46.99 36.03,46.99 IC1.7 | IC1.2 40.01,45 | 40.01,45 40.01,40.01 40.64,39.37 53.34,39.37 v53.98,38.73 | X2.1 88.9,44.78 88.27,45.41 88.27,48.9 85.09,52.07 84.45,52.07 | 83.19,52.07 79.38,48.26 79.38,39.37 78.11,38.1 v69.85,38.1 | 84.45,52.07 83.19,52.07 | 84.45,52.07 83.82,52.7 83.19,52.07
  Bottom 1.27: 83.82,52.7 D1.A
XTAL1
  Bottom 0.406: 25.4,48.26 22.23,48.26 21.59,48.9 R12.1 21.59,49.66 C1.2 | 25.4,48.26 X1.P$1 | 25.4,48.26 27.3,48.26 27.94,48.9 27.94,49.37 28.57,50 IC1.16

### Text on the board
tNames: 1 | BLK | D11 | EC11E / Encoder | 5V
bNames: Bio4_LCD_v1.1
tValues: Simple spectro / V 2.0.0
bValues: GND | GND | + | GND | GND | GND | GND | GND | + | Simple spectro / V 2.0.0
bDocu: N | M | L | K | J | I | H | G | F | E | B | A | C | D | Green | Blue | Red